# EAGLE design JEEP_Aux_Control_PCB (EAGLE 9.6.2)
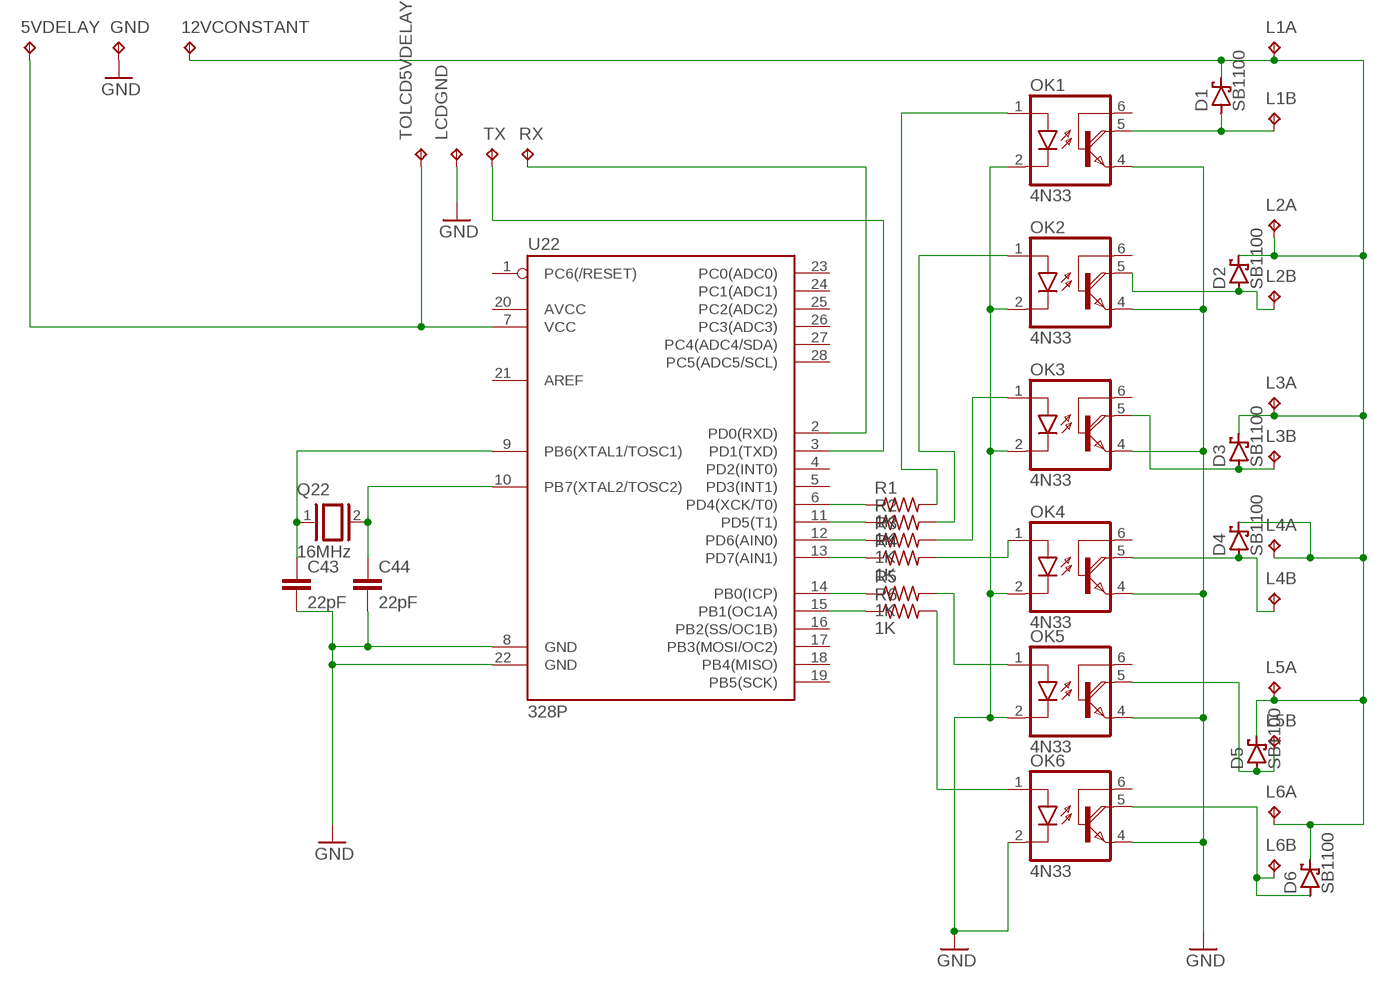
[diagram p0: schematic, sheet 1]

## Parts
5VDELAY  TPPAD1-13Y  [P1-13Y]
12VCONSTANT  TPPAD1-13Y  [P1-13Y]
C43  22pF  22PF-PTH-2.54MM-200V-5%  [CAP-PTH-2.54]
C44  22pF  22PF-PTH-2.54MM-200V-5%  [CAP-PTH-2.54]
D1  SB1100  SCHOTTKY-DIODECB417-15  [CB417-15]
D2  SB1100  SCHOTTKY-DIODECB417-15  [CB417-15]
D3  SB1100  SCHOTTKY-DIODECB417-15  [CB417-15]
D4  SB1100  SCHOTTKY-DIODECB417-15  [CB417-15]
D5  SB1100  SCHOTTKY-DIODECB417-15  [CB417-15]
D6  SB1100  SCHOTTKY-DIODECB417-15  [CB417-15]
GND  TPPAD1-13Y  [P1-13Y]
L1A  TPPAD1-13Y  [P1-13Y]
L1B  TPPAD1-13Y  [P1-13Y]
L2A  TPPAD1-13Y  [P1-13Y]
L2B  TPPAD1-13Y  [P1-13Y]
L3A  TPPAD1-13Y  [P1-13Y]
L3B  TPPAD1-13Y  [P1-13Y]
L4A  TPPAD1-13Y  [P1-13Y]
L4B  TPPAD1-13Y  [P1-13Y]
L5A  TPPAD1-13Y  [P1-13Y]
L5B  TPPAD1-13Y  [P1-13Y]
L6A  TPPAD1-13Y  [P1-13Y]
L6B  TPPAD1-13Y  [P1-13Y]
LCDGND  TPPAD1-13Y  [P1-13Y]
OK1  4N33  [DIL06]
OK2  4N33  [DIL06]
OK3  4N33  [DIL06]
OK4  4N33  [DIL06]
OK5  4N33  [DIL06]
OK6  4N33  [DIL06]
Q22  16MHz  XTAL  [Q]
R1  1K  R-US_R0603  [R0603]
R2  1K  R-US_R0603  [R0603]
R3  1K  R-US_R0603  [R0603]
R4  1K  R-US_R0603  [R0603]
R5  1K  R-US_R0603  [R0603]
R6  1K  R-US_R0603  [R0603]
RX  TPPAD1-13Y  [P1-13Y]
TOLCD5VDELAY  TPPAD1-13Y  [P1-13Y]
TX  TPPAD1-13Y  [P1-13Y]
U22  328P  ATMEGA328P_PDIP  [DIP28]

## Nets
GND: C43.2 C44.2 GND.TP LCDGND.TP OK1.2(C) OK1.4(E) OK2.2(C) OK2.4(E) OK3.2(C) OK3.4(E) OK4.2(C) OK4.4(E) OK5.2(C) OK5.4(E) OK6.2(C) OK6.4(E) U22.8(GND) U22.22(GND)
N$1: R1.1 U22.6(PD4(XCK/T0))
N$2: R2.1 U22.11(PD5(T1))
N$3: R3.1 U22.12(PD6(AIN0))
N$4: R4.1 U22.13(PD7(AIN1))
N$5: R5.1 U22.14(PB0(ICP))
N$6: R6.1 U22.15(PB1(OC1A))
N$7: OK1.1(A) R1.2
N$8: OK2.1(A) R2.2
N$9: OK3.1(A) R3.2
N$10: OK4.1(A) R4.2
N$11: OK5.1(A) R5.2
N$12: OK6.1(A) R6.2
N$13: D1.A L1B.TP OK1.5(COL)
N$14: D2.A L2B.TP OK2.5(COL)
N$15: D3.A L3B.TP OK3.5(COL)
N$16: D4.A L4B.TP OK4.5(COL)
N$17: D5.A L5B.TP OK5.5(COL)
N$18: D6.A L6B.TP OK6.5(COL)
N$20: TX.TP U22.3(PD1(TXD))
N$21: 5VDELAY.TP TOLCD5VDELAY.TP U22.7(VCC)
N$22: RX.TP U22.2(PD0(RXD))
N$23: 12VCONSTANT.TP D1.C D2.C D3.C D4.C D5.C D6.C L1A.TP L2A.TP L3A.TP L4A.TP L5A.TP L6A.TP
N$211: C43.1 Q22.1 U22.9(PB6(XTAL1/TOSC1))
N$212: C44.1 Q22.2 U22.10(PB7(XTAL2/TOSC2))
Unconnected: OK1.6(B) OK2.6(B) OK3.6(B) OK4.6(B) OK5.6(B) OK6.6(B) U22.1(PC6(/RESET)) U22.4(PD2(INT0)) U22.5(PD3(INT1)) U22.16(PB2(SS/OC1B)) U22.17(PB3(MOSI/OC2)) U22.18(PB4(MISO)) U22.19(PB5(SCK)) U22.20(AVCC) U22.21(AREF) U22.23(PC0(ADC0)) U22.24(PC1(ADC1)) U22.25(PC2(ADC2)) U22.26(PC3(ADC3)) U22.27(PC4(ADC4/SDA)) U22.28(PC5(ADC5/SCL))

## Library data of the parts
5VDELAY 12VCONSTANT GND L1A L1B L2A L2B L3A L3B L4A L4B L5A L5B L6A L6B LCDGND RX TOLCD5VDELAY TX = testpad:TP: Test pad
C43 C44 = SparkFun-Capacitors:22PF: 22pF ceramic capacitors A capacitor is a passive two-terminal electrical component used to store electrical energy temporarily in an electric field.; PROD_ID: CAP-09128
D1-D6 = diode:SCHOTTKY-DIODE: Schottky Diode
OK1-OK6 = optocoupler:4N33: MOTOROLA OPTO COUPLER; MF: VISHAY/TELEFUNKEN; MPN: 4N33; OC_FARNELL: 1469601; OC_NEWARK: 88K1390
Q22 = special:XTAL: CRYSTAL
R1-R6 = rcl:R-US_: RESISTOR, American symbol; SPICEPREFIX: R
U22 = SparkFun-IC-Microcontroller:ATMEGA328P_PDIP: Atmel 328P Through hole ATMEGA328P uC used in the Arduino 32kb flash, 1k EEPROM, 2k SRAM Datasheet <http://www.sparkfun.com/datasheets/Components/SMD/ATMega328.pdf> SparkFun Products Storefront component: AVR 28 Pin 20MHz 32K 6A/D - ATMega328P <https://www.sparkfun.com/products/9061> (COM-09061) SparkFun Simon Says - Through-Hole Soldering Kit <https://www.sparkfun.com/products/10547> (KIT-10547) SparkFun Learn to Solder - Simon Says <https://www.sparkfun.com/products/13708> (KIT-13708) SparkFun BigTime Watch Kit <https://www.sparkfun.com/products/11734> (KIT-11734) SparkFun ClockIt <https://www.sparkfun.com/products/10930> (KIT-10930) SparkFun Serial Enabled LCD Kit <https://www.sparkfun.com/products/10097> (LCD-10097) SparkFun Simon Tilts - Through Hole Soldering Kit <https://www.sparkfun.com/products/12634> (KIT-12634) SparkFun Frequency Counter Kit <https://www.sparkfun.com/products/10140> (KIT-10140) FabFM Radio Kit <https://www.sparkfun.com/products/11043> (KIT-11043) SparkFun Binary Blaster Kit <https://www.sparkfun.com/products/12037> (KIT-12037) SparkFun Metro-Gnome <https://www.sparkfun.com/products/9236> (KIT-09236) ATmega328 with Arduino Optiboot (Uno) <https://www.sparkfun.com/products/10524> (DEV-10524); PROD_ID: IC-09136

## Net classes
0 default: width 0.305 mm, drill 0.508 mm, clearance 0.254 mm

## Board
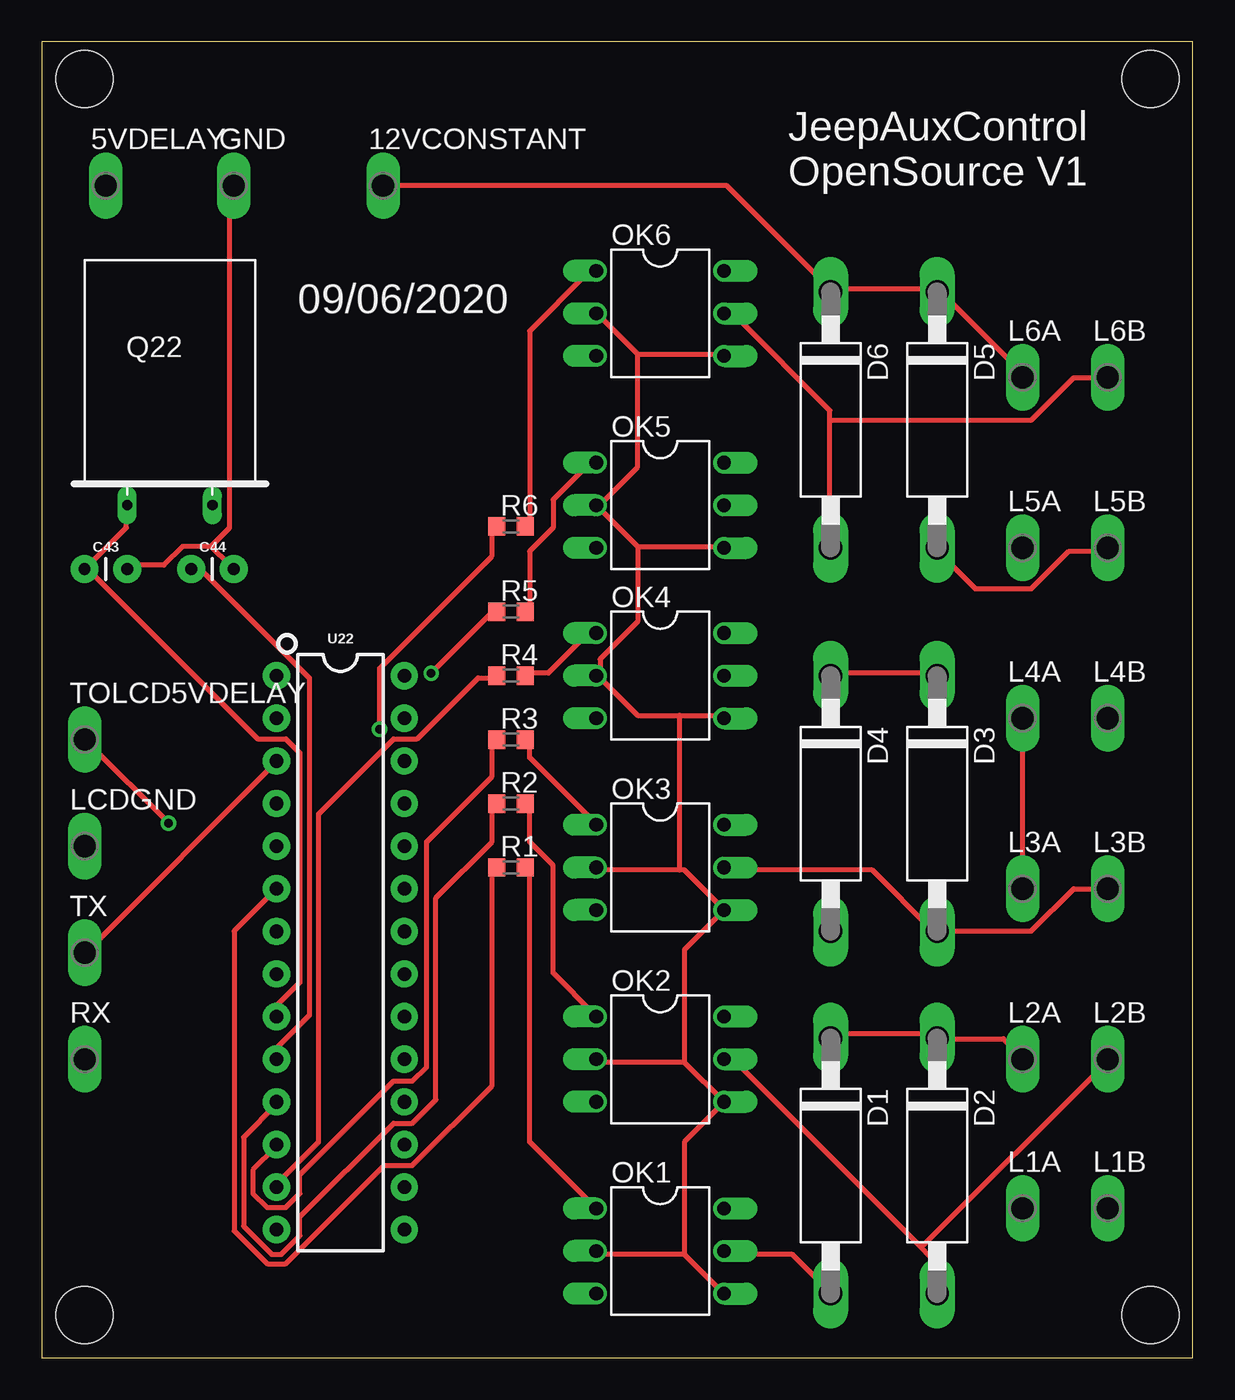
[diagram p1: board, top side]
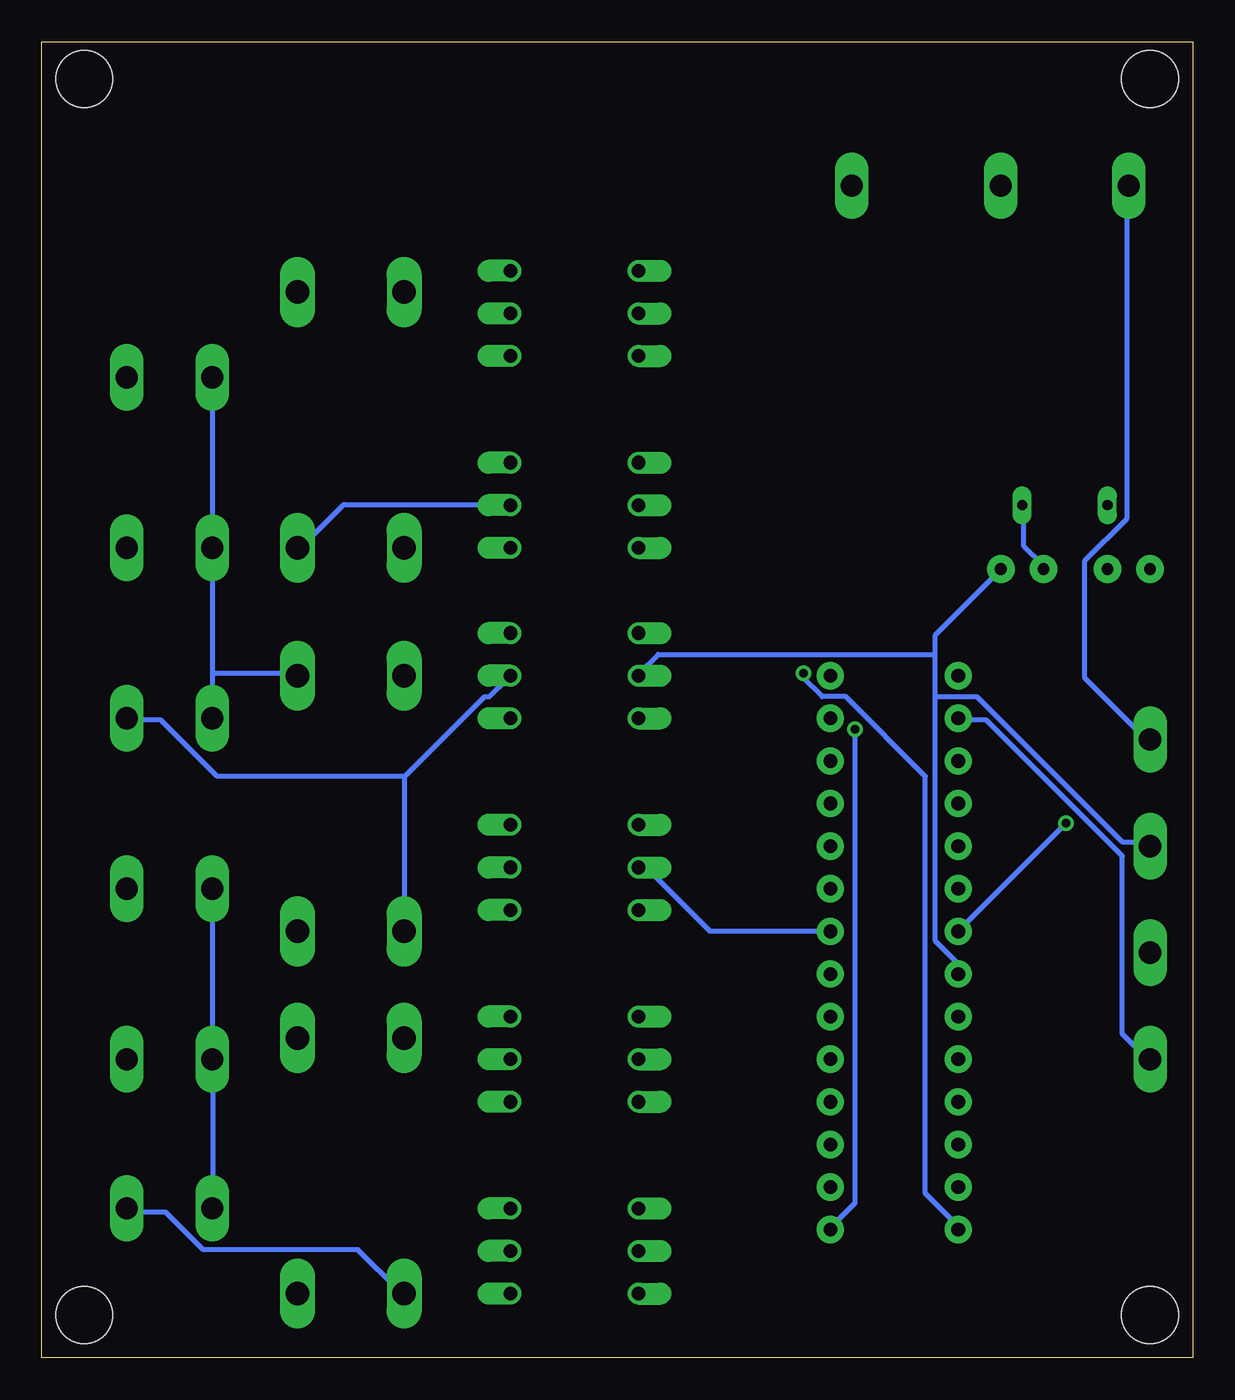
[diagram p2: board, bottom side, seen from below]

Size 68.56 x 78.41 mm. Coordinates in mm from the lower left corner, seen from the top.
Outline: 0,0 68.56,0 68.56,78.41 0,78.41 0,0
Copper layers (1*16): Top 0.035mm / dielectric 1.5mm / Bottom 0.035mm
Design rules "default": minimum track width 6mil, minimum drill 0.35mm, track to track 6mil, track to pad 6mil, pad to pad 6mil, via to via 6mil, smd to smd 6mil, copper to edge 40mil, drill to drill 6mil, minimum pad ring 10mil, minimum via ring 8mil, stop-mask expansion 4mil, vias tented up to drill 0mil, thermal gap 10mil
Holes 3.38 mm at 66.04,76.2 2.54,2.54 66.04,2.54 2.54,76.2

### Footprints (pad centres in the part's own frame; a part is rotated, then mirrored left to right if it is on the bottom)
P1-13Y = drill 1.321 pad 1.905 long: TP 0,0
CAP-PTH-2.54 = drill 0.7 pad 1.651: 1 -1.27,0; 2 1.27,0
CB417-15 = drill 1.397 long: A 7.62,0; C -7.62,0
DIL06 = drill 0.813 offset: 1 -2.54,-3.81; 2 0,-3.81; 3 2.54,-3.81; 4 2.54,3.81; 5 0,3.81; 6 -2.54,3.81
Q = drill 0.61 long: 1 -2.54,-7.62; 2 2.54,-7.62
R0603 = smd 1 x 1.1: 1 -0.85,0; 2 0.85,0
DIP28 = drill 0.813 pad 1.626: 1 -16.51,-3.81; 2 -13.97,-3.81; 3 -11.43,-3.81; 4 -8.89,-3.81; 5 -6.35,-3.81; 6 -3.81,-3.81; 7 -1.27,-3.81; 8 1.27,-3.81; 9 3.81,-3.81; 10 6.35,-3.81; 11 8.89,-3.81; 12 11.43,-3.81; 13 13.97,-3.81; 14 16.51,-3.81; 15 16.51,3.81; 16 13.97,3.81; 17 11.43,3.81; 18 8.89,3.81; 19 6.35,3.81; 20 3.81,3.81; 21 1.27,3.81; 22 -1.27,3.81; 23 -3.81,3.81; 24 -6.35,3.81; 25 -8.89,3.81; 26 -11.43,3.81; 27 -13.97,3.81; 28 -16.51,3.81

### Placement (x,y rotation side)
5VDELAY  3.81,69.85 0 top
12VCONSTANT  20.32,69.85 0 top
C43  3.81,46.99 0 top
C44  10.16,46.99 0 top
D1  46.99,11.43 270 top
D2  53.34,11.43 270 top
D3  53.34,33.02 270 top
D4  46.99,33.02 270 top
D5  53.34,55.88 270 top
D6  46.99,55.88 270 top
GND  11.43,69.85 0 top
L1A  58.42,8.89 0 top
L1B  63.5,8.89 0 top
L2A  58.42,17.78 0 top
L2B  63.5,17.78 0 top
L3A  58.42,27.94 0 top
L3B  63.5,27.94 0 top
L4A  58.42,38.1 0 top
L4B  63.5,38.1 0 top
L5A  58.42,48.26 0 top
L5B  63.5,48.26 0 top
L6A  58.42,58.42 0 top
L6B  63.5,58.42 0 top
LCDGND  2.54,30.48 0 top
OK1  36.83,6.35 270 top
OK2  36.83,17.78 270 top
OK3  36.83,29.21 270 top
OK4  36.83,40.64 270 top
OK5  36.83,50.8 270 top
OK6  36.83,62.23 270 top
Q22  7.62,58.42 0 top
R1  27.94,29.21 0 top
R2  27.94,33.02 0 top
R3  27.94,36.83 0 top
R4  27.94,40.64 0 top
R5  27.94,44.45 0 top
R6  27.94,49.53 0 top
RX  2.54,17.78 0 top
TOLCD5VDELAY  2.54,36.83 0 top
TX  2.54,24.13 0 top
U22  17.78,24.13 270 top

### Tracks (layer width: path | path; a pad name or v marks a point on that pad's centre or on a via)
GND
  Top 0.305: 10.06,48.34 8.38,48.34 7.26,47.22 5.31,47.22 C43.2 | 10.06,48.34 11.18,47.22 C44.2 | 10.06,48.34 11.18,49.45 11.18,69.85 GND.TP | 35.48,59.79 40.51,59.79 OK6.4 | 35.48,59.79 33.25,62.03 OK6.2 | 38,38.28 35.48,38.28 33.25,40.51 OK4.2 33.25,40.79 33.25,41.63 35.48,43.87 35.48,48.34 | 38,38.28 40.51,38.28 OK4.4 | 35.48,48.34 40.51,48.34 OK5.4 | 35.48,48.34 OK5.2 33.25,50.85 35.48,53.09 35.48,59.79 | 38.28,6.15 33.25,6.15 OK1.2 | 38.28,6.15 40.51,3.91 OK1.4 | 38.28,17.6 33.25,17.6 OK2.2 | 38.28,17.6 OK2.4 40.51,15.09 38.28,12.85 38.28,6.15 | 38,29.06 38.28,29.06 40.51,26.82 OK3.4 38.28,24.31 38.28,17.6 | 38,29.06 33.25,29.06 OK3.2 | 38,29.06 38,38.28
  Bottom 0.305: U22.8 13.97,23.47 15.37,24.87 15.37,39.4 | 15.37,41.91 15.37,43.03 11.46,46.94 C44.2 | 15.37,41.91 15.37,39.4 | 15.37,39.4 12.85,39.4 4.19,30.73 2.79,30.73 LCDGND.TP | U22.22 21.79,25.43 28.78,25.43 32.41,29.06 32.97,29.06 OK3.2 | 15.37,41.91 31.85,41.91 32.97,40.79 OK4.2
N$1
  Top 0.305: U22.6 11.46,25.43 11.46,7.54 13.41,5.59 14.53,5.59 20.4,11.46 22.07,11.46 26.82,16.2 26.82,29.06 R1.1
N$2
  Top 0.305: R2.1 26.82,32.97 26.82,30.73 23.47,27.38 23.47,15.37 22.07,13.97 20.95,13.97 15.37,8.38 15.37,7.26 14.25,6.15 13.69,6.15 12.01,7.82 12.01,13.13 13.97,15.09 U22.11
N$3
  Top 0.305: R3.1 26.82,36.6 26.82,34.65 22.91,30.73 22.91,17.32 22.07,16.48 20.95,16.48 15.37,10.9 15.37,9.78 14.53,8.94 13.41,8.94 12.57,9.78 12.57,11.18 13.97,12.57 U22.12
N$4
  Top 0.305: R4.1 26.82,40.51 25.98,40.51 22.35,36.88 20.95,36.88 16.48,32.41 16.48,12.85 13.97,10.34 U22.13
N$5  (via drill 0.51)
  Top 0.305: v23.19,40.79 26.82,44.42 R5.1
  Bottom 0.305: v23.19,40.79 23.19,40.51 22.07,39.4 20.68,39.4 15.93,34.65 15.93,9.78 13.97,7.82 U22.14
N$6  (via drill 0.51)
  Top 0.305: v20.12,37.44 20.12,41.07 26.82,47.78 26.82,49.45 R6.1
  Bottom 0.305: v20.12,37.44 20.12,9.22 21.51,7.82 U22.15
N$7
  Top 0.305: OK1.1 29.06,12.85 29.06,29.06 R1.2
N$8
  Top 0.305: R2.2 29.06,32.97 29.06,30.73 30.45,29.34 30.45,22.91 32.97,20.4 OK2.1
N$9
  Top 0.305: R3.2 29.06,36.6 29.06,35.76 32.97,31.85 OK3.1
N$10
  Top 0.305: R4.2 29.06,40.79 30.18,40.79 32.41,43.03 32.97,43.03 OK4.1
N$11
  Top 0.305: R5.2 29.06,44.7 29.06,48.06 30.45,49.45 30.45,51.13 32.41,53.09 32.97,53.09 OK5.1
N$12
  Top 0.305: R6.2 29.06,49.73 29.06,61.19 32.41,64.54 32.97,64.54 OK6.1
N$13
  Top 0.305: OK1.5 40.79,6.15 44.7,6.15 46.94,3.91 D1.A
  Bottom 0.305: L1B.TP 63.42,8.66 61.19,8.66 58.95,6.43 49.73,6.43 47.22,3.91 D1.A
N$14
  Top 0.305: 52.25,6.71 53.09,5.87 53.09,3.91 D2.A | 52.25,6.71 41.35,17.6 40.79,17.6 OK2.5 | 52.25,6.71 52.53,6.71 63.42,17.6 L2B.TP
N$15
  Top 0.305: OK3.5 40.79,29.06 49.45,29.06 53.09,25.43 D3.A 53.37,25.43 58.95,25.43 61.47,27.94 L3B.TP
N$16
  Bottom 0.305: 46.94,34.65 42.19,39.4 41.91,39.4 40.79,40.51 OK4.5 | 46.94,34.65 46.94,25.43 D4.A | 46.94,34.65 58.12,34.65 61.47,38 63.42,38 L4B.TP
N$17
  Top 0.305: L5B.TP 63.42,48.06 61.19,48.06 58.95,45.82 55.6,45.82 53.37,48.06 D5.A
  Bottom 0.305: OK5.5 40.79,50.85 50.57,50.85 53.09,48.34 D5.A
N$18
  Top 0.305: 46.94,55.88 46.94,48.34 D6.A | 46.94,55.88 46.94,56.44 41.35,62.03 40.79,62.03 OK6.5 | 46.94,55.88 58.95,55.88 61.47,58.4 63.42,58.4 L6B.TP
N$20
  Top 0.305: U22.3 13.97,35.48 2.79,24.31 TX.TP
N$21  (via drill 0.51)
  Top 0.305: v7.54,31.85 2.79,36.6 TOLCD5VDELAY.TP
  Bottom 0.305: v7.54,31.85 13.97,25.43 U22.7 | 5VDELAY.TP 3.91,69.85 3.91,50.01 6.43,47.5 6.43,40.51 2.79,36.88 TOLCD5VDELAY.TP
N$22
  Bottom 0.305: U22.2 13.97,38 12.29,38 4.19,29.9 4.19,19.28 2.79,17.88 RX.TP
N$23
  Top 0.305: L6A.TP 58.4,58.67 53.37,63.7 D5.C 53.09,63.7 47.22,63.7 D6.C 46.94,63.7 40.79,69.85 12VCONSTANT.TP | D1.C 47.22,19.28 53.09,19.28 53.31,19.05 D2.C 53.37,19 57.28,19 58.42,17.86 L2A.TP | D4.C 47.22,40.79 53.09,40.79 D3.C | L3A.TP 58.4,27.94 58.4,38 L4A.TP
  Bottom 0.305: L1A.TP 58.4,8.94 58.4,17.6 58.42,17.63 L2A.TP 58.4,17.8 58.4,27.94 L3A.TP | 58.4,40.79 58.4,38.28 L4A.TP | 58.4,40.79 58.4,48.06 L5A.TP 58.4,48.34 58.4,58.4 L6A.TP | 58.4,40.79 53.37,40.79 D3.C
N$211
  Top 0.305: Q22.1 5.03,50.57 5.03,49.45 2.79,47.22 C43.1 2.79,46.94 12.85,36.88 14.53,36.88 15.37,36.04 15.37,22.35 13.97,20.95 U22.9
N$212
  Top 0.305: U22.10 13.97,18.44 15.93,20.4 15.93,40.51 9.5,46.94 8.94,46.94 C44.1
  Bottom 0.305: Q22.2 10.06,50.57 10.06,48.34 8.94,47.22 C44.1

### Text on the board
tNames: JeepAuxControl / OpenSource V1 | 09/06/2020